# EAGLE design TheSmartTenDollarJobKaufman (EAGLE 6.4)
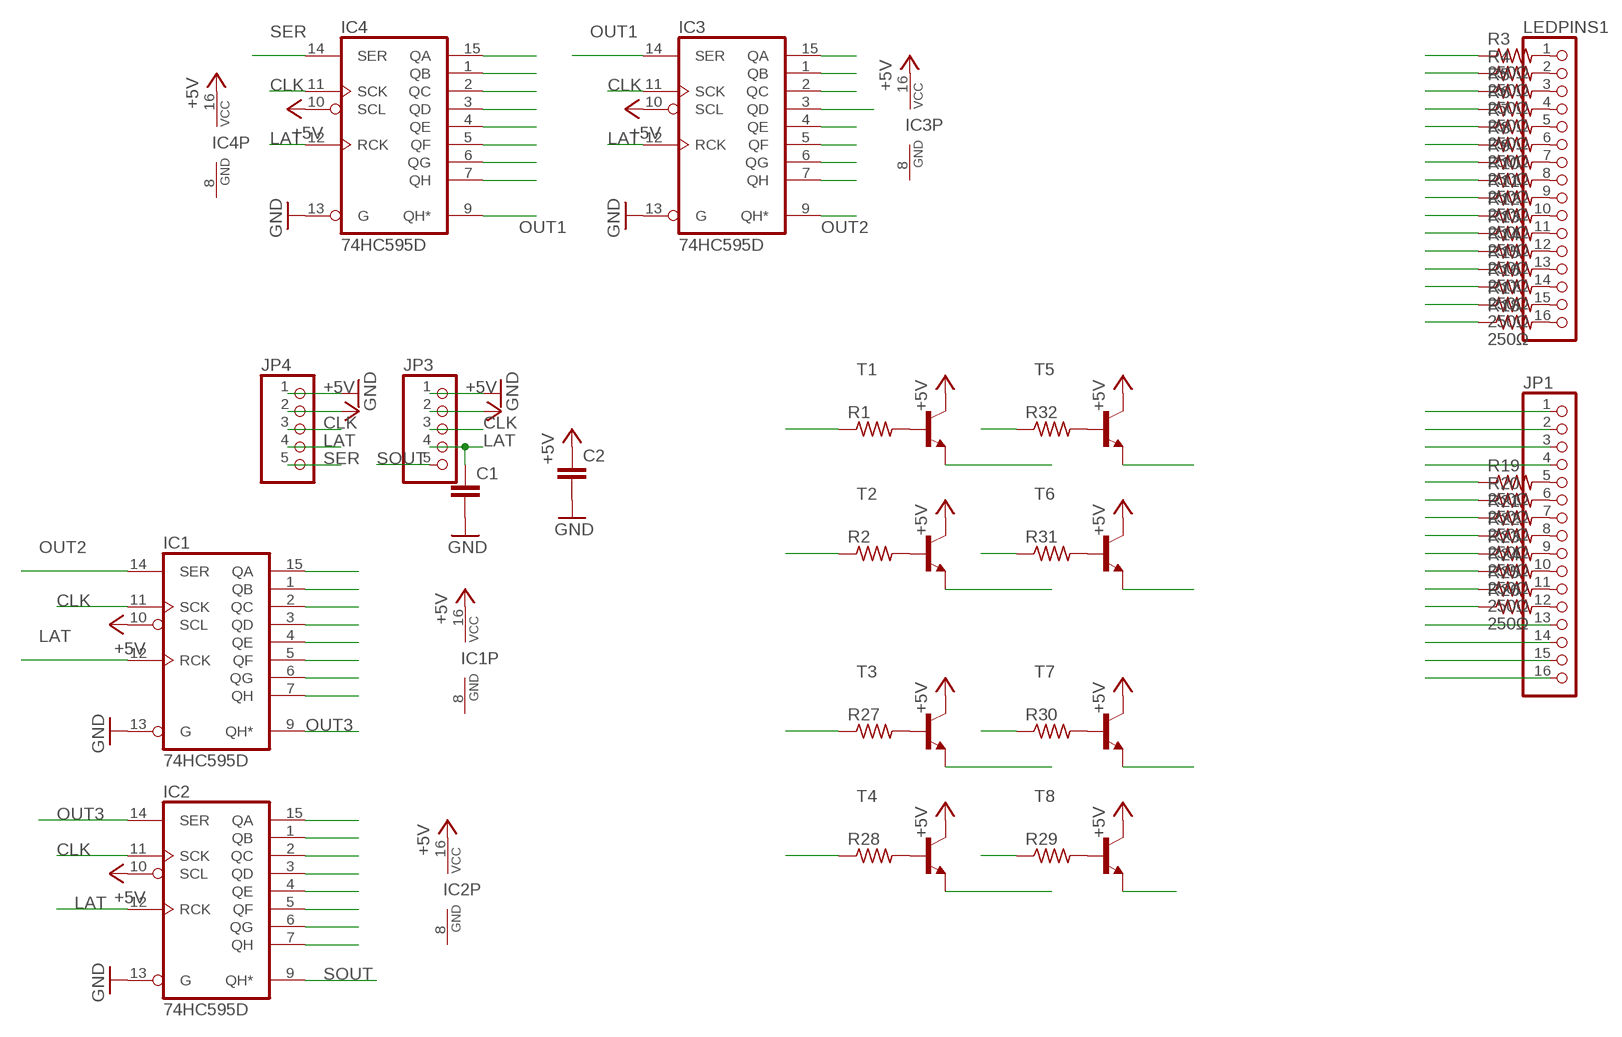
[diagram p0: schematic, sheet 1]

## Parts
C1  C-EUC0603  [C0603]
C2  C-EUC0603  [C0603]
IC1  74HC595D  [SO16]
IC2  74HC595D  [SO16]
IC3  74HC595D  [SO16]
IC4  74HC595D  [SO16]
JP1  PINHD-1X16  [1X16]
JP3  PINHD-1X5  [1X05]
JP4  PINHD-1X5  [1X05]
LEDPINS1  PINHD-1X16  [1X16]
R1  R-US_R0603  [R0603]
R2  R-US_R0603  [R0603]
R3  250Ω  R-US_R0603  [R0603]
R4  250Ω  R-US_R0603  [R0603]
R5  250Ω  R-US_R0603  [R0603]
R6  250Ω  R-US_R0603  [R0603]
R7  250Ω  R-US_R0603  [R0603]
R8  250Ω  R-US_R0603  [R0603]
R9  250Ω  R-US_R0603  [R0603]
R10  250Ω  R-US_R0603  [R0603]
R11  250Ω  R-US_R0603  [R0603]
R12  250Ω  R-US_R0603  [R0603]
R13  250Ω  R-US_R0603  [R0603]
R14  250Ω  R-US_R0603  [R0603]
R15  250Ω  R-US_R0603  [R0603]
R16  250Ω  R-US_R0603  [R0603]
R17  250Ω  R-US_R0603  [R0603]
R18  250Ω  R-US_R0603  [R0603]
R19  250Ω  R-US_R0603  [R0603]
R20  250Ω  R-US_R0603  [R0603]
R21  250Ω  R-US_R0603  [R0603]
R22  250Ω  R-US_R0603  [R0603]
R23  250Ω  R-US_R0603  [R0603]
R24  250Ω  R-US_R0603  [R0603]
R25  250Ω  R-US_R0603  [R0603]
R26  250Ω  R-US_R0603  [R0603]
R27  R-US_R0603  [R0603]
R28  R-US_R0603  [R0603]
R29  R-US_R0603  [R0603]
R30  R-US_R0603  [R0603]
R31  R-US_R0603  [R0603]
R32  R-US_R0603  [R0603]
T1  -NPN-SOT23-CBE  [SOT23-EBC]
T2  -NPN-SOT23-CBE  [SOT23-EBC]
T3  -NPN-SOT23-CBE  [SOT23-EBC]
T4  -NPN-SOT23-CBE  [SOT23-EBC]
T5  -NPN-SOT23-CBE  [SOT23-EBC]
T6  -NPN-SOT23-CBE  [SOT23-EBC]
T7  -NPN-SOT23-CBE  [SOT23-EBC]
T8  -NPN-SOT23-CBE  [SOT23-EBC]

## Nets
+5V: C2.1 IC1.10(SCL) IC1.16(VCC) IC2.10(SCL) IC2.16(VCC) IC3.10(SCL) IC3.16(VCC) IC4.10(SCL) IC4.16(VCC) JP3.2 JP4.2 T1.C T2.C T3.C T4.C T5.C T6.C T7.C T8.C
CLK: IC1.11(SCK) IC2.11(SCK) IC3.11(SCK) IC4.11(SCK) JP3.3 JP4.3
GND: C1.2 C2.2 IC1.13(G) IC2.13(G) IC3.13(G) IC4.13(G) JP3.1 JP4.1
LAT: C1.1 IC1.12(RCK) IC2.12(RCK) IC3.12(RCK) IC4.12(RCK) JP3.4 JP4.4
N$1: IC3.15(QA) R3.1
N$2: IC3.7(QH) R4.1
N$3: IC3.6(QG) R5.1
N$4: IC3.5(QF) R6.1
N$5: IC3.4(QE) R7.1
N$6: IC3.3(QD) R8.1
N$7: IC3.2(QC) R9.1
N$8: IC3.1(QB) R10.1
N$9: IC4.7(QH) R11.1
N$10: IC4.6(QG) R12.1
N$11: IC4.5(QF) R13.1
N$12: IC4.4(QE) R14.1
N$13: IC4.3(QD) R15.1
N$14: IC4.2(QC) R16.1
N$15: IC4.1(QB) R17.1
N$16: IC4.15(QA) R18.1
N$17: JP1.1 T1.B(E)
N$18: JP1.2 T2.B(E)
N$19: JP1.3 T3.B(E)
N$20: JP1.4 T4.B(E)
N$21: IC1.4(QE) R19.1
N$22: IC1.5(QF) R20.1
N$23: IC1.6(QG) R21.1
N$24: IC1.7(QH) R22.1
N$25: IC2.1(QB) R23.1
N$26: IC2.2(QC) R24.1
N$27: IC2.3(QD) R25.1
N$28: IC2.4(QE) R26.1
N$29: JP1.13 T5.B(E)
N$30: JP1.14 T6.B(E)
N$31: JP1.15 T7.B(E)
N$32: JP1.16 T8.B(E)
N$33: LEDPINS1.1 R3.2
N$34: R1.2 T1.E(B)
N$35: LEDPINS1.2 R4.2
N$36: LEDPINS1.3 R5.2
N$37: LEDPINS1.4 R6.2
N$38: LEDPINS1.5 R7.2
N$39: LEDPINS1.6 R8.2
N$40: LEDPINS1.7 R9.2
N$41: LEDPINS1.8 R10.2
N$42: LEDPINS1.9 R11.2
N$43: LEDPINS1.10 R12.2
N$44: LEDPINS1.11 R13.2
N$45: LEDPINS1.12 R14.2
N$46: LEDPINS1.13 R15.2
N$47: LEDPINS1.14 R16.2
N$48: LEDPINS1.15 R17.2
N$49: LEDPINS1.16 R18.2
N$50: JP1.5 R19.2
N$51: JP1.6 R20.2
N$52: JP1.7 R21.2
N$53: JP1.8 R22.2
N$54: JP1.9 R23.2
N$55: JP1.10 R24.2
N$56: JP1.11 R25.2
N$57: JP1.12 R26.2
N$58: R2.2 T2.E(B)
N$59: R27.2 T3.E(B)
N$60: R28.2 T4.E(B)
N$61: R29.2 T8.E(B)
N$62: R30.2 T7.E(B)
N$63: R31.2 T6.E(B)
N$64: R32.2 T5.E(B)
OUT1: IC3.14(SER) IC4.9(QH*)
OUT2: IC1.14(SER) IC3.9(QH*)
OUT3: IC1.9(QH*) IC2.14(SER)
QA: IC1.15(QA) R1.1
QB: IC1.1(QB) R2.1
QC: IC1.2(QC) R27.1
QD: IC1.3(QD) R28.1
QE: IC2.5(QF) R32.1
QF: IC2.6(QG) R31.1
QG: IC2.7(QH) R30.1
QH: IC2.15(QA) R29.1
SER: IC4.14(SER) JP4.5
SOUT: IC2.9(QH*) JP3.5

## Power pins joined to a net without a drawn wire
GND: IC1.8(GND) IC2.8(GND) IC3.8(GND) IC4.8(GND)

## Library data of the parts
C1 C2 = rcl:C-EU: CAPACITOR, European symbol
IC1-IC4 = 74xx-eu:74*595: 8-bit SHIFT REGISTER, output latch
JP1 LEDPINS1 = pinhead:PINHD-1X16: PIN HEADER
JP3 JP4 = pinhead:PINHD-1X5: PIN HEADER
R1 R2 R27-R32 = resistor:R-US_: RESISTOR, American symbol
R3-R26 = rcl:R-US_: RESISTOR, American symbol
T1-T8 = transistor:*-NPN-: NPN Transistror BF959 corrected 2008.03.06

## Board
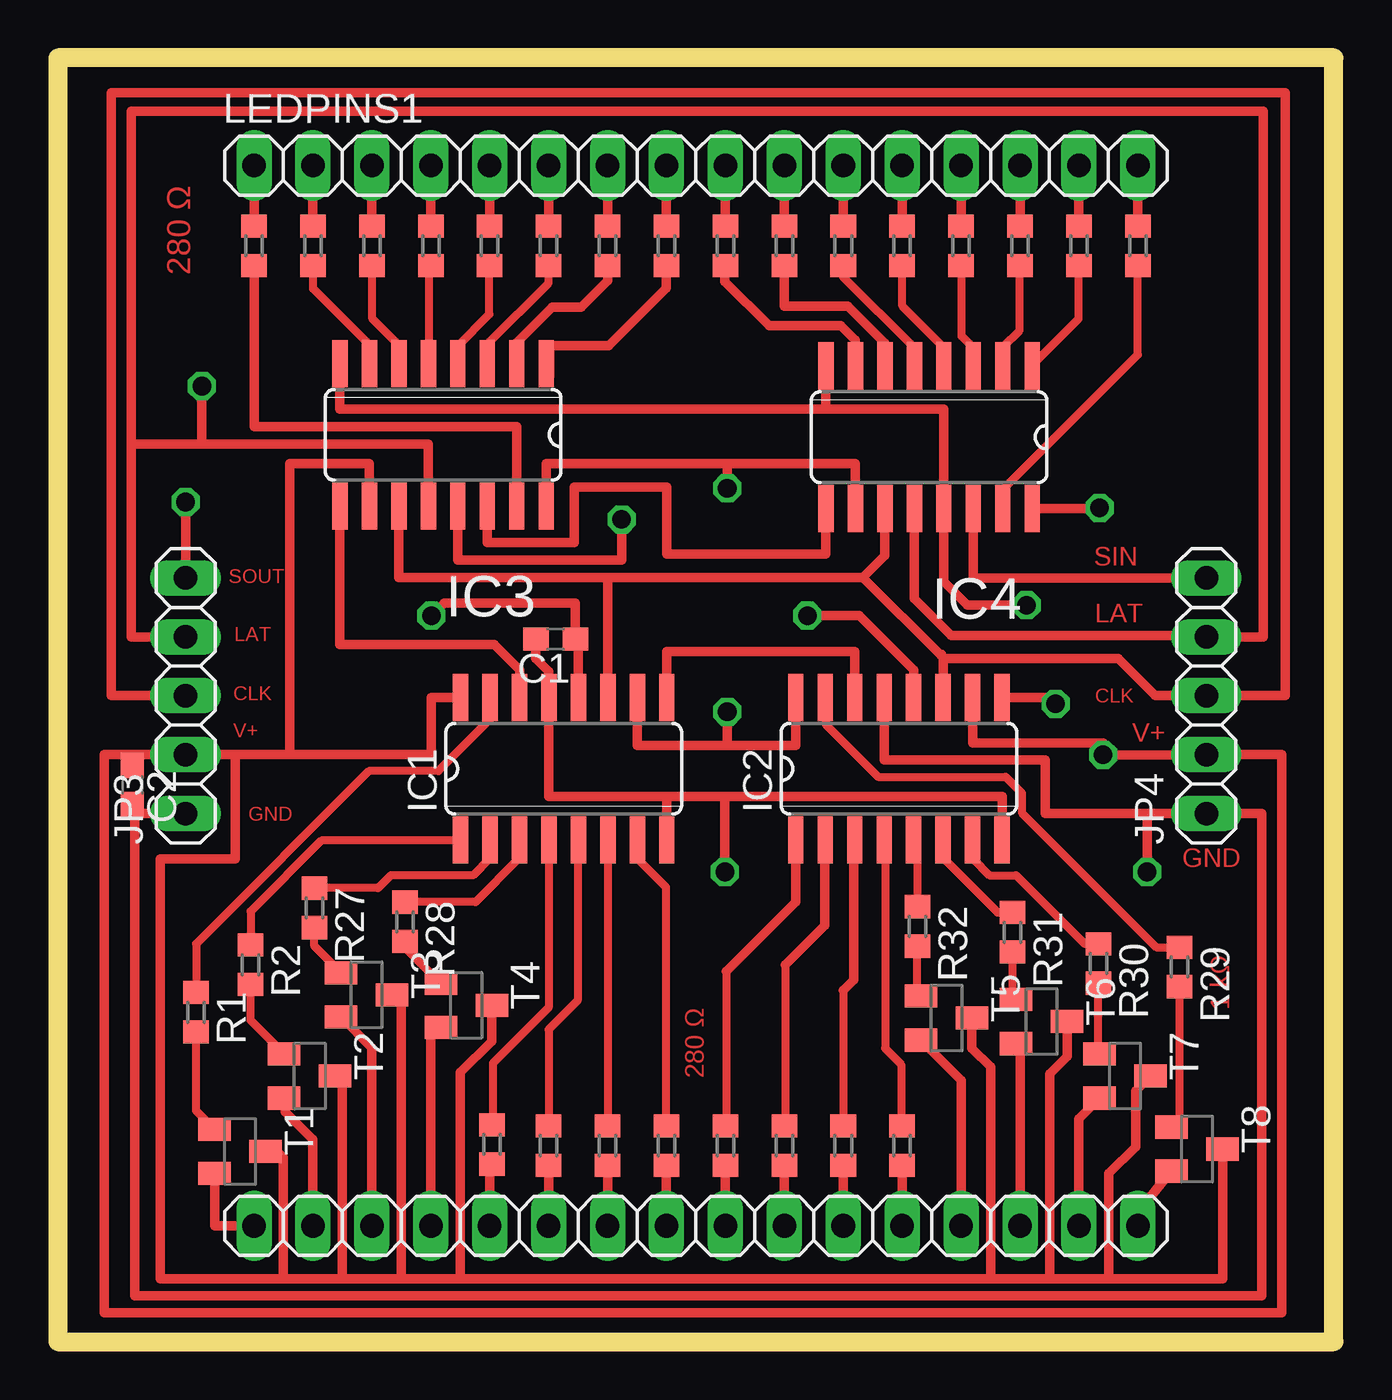
[diagram p1: board, top side]
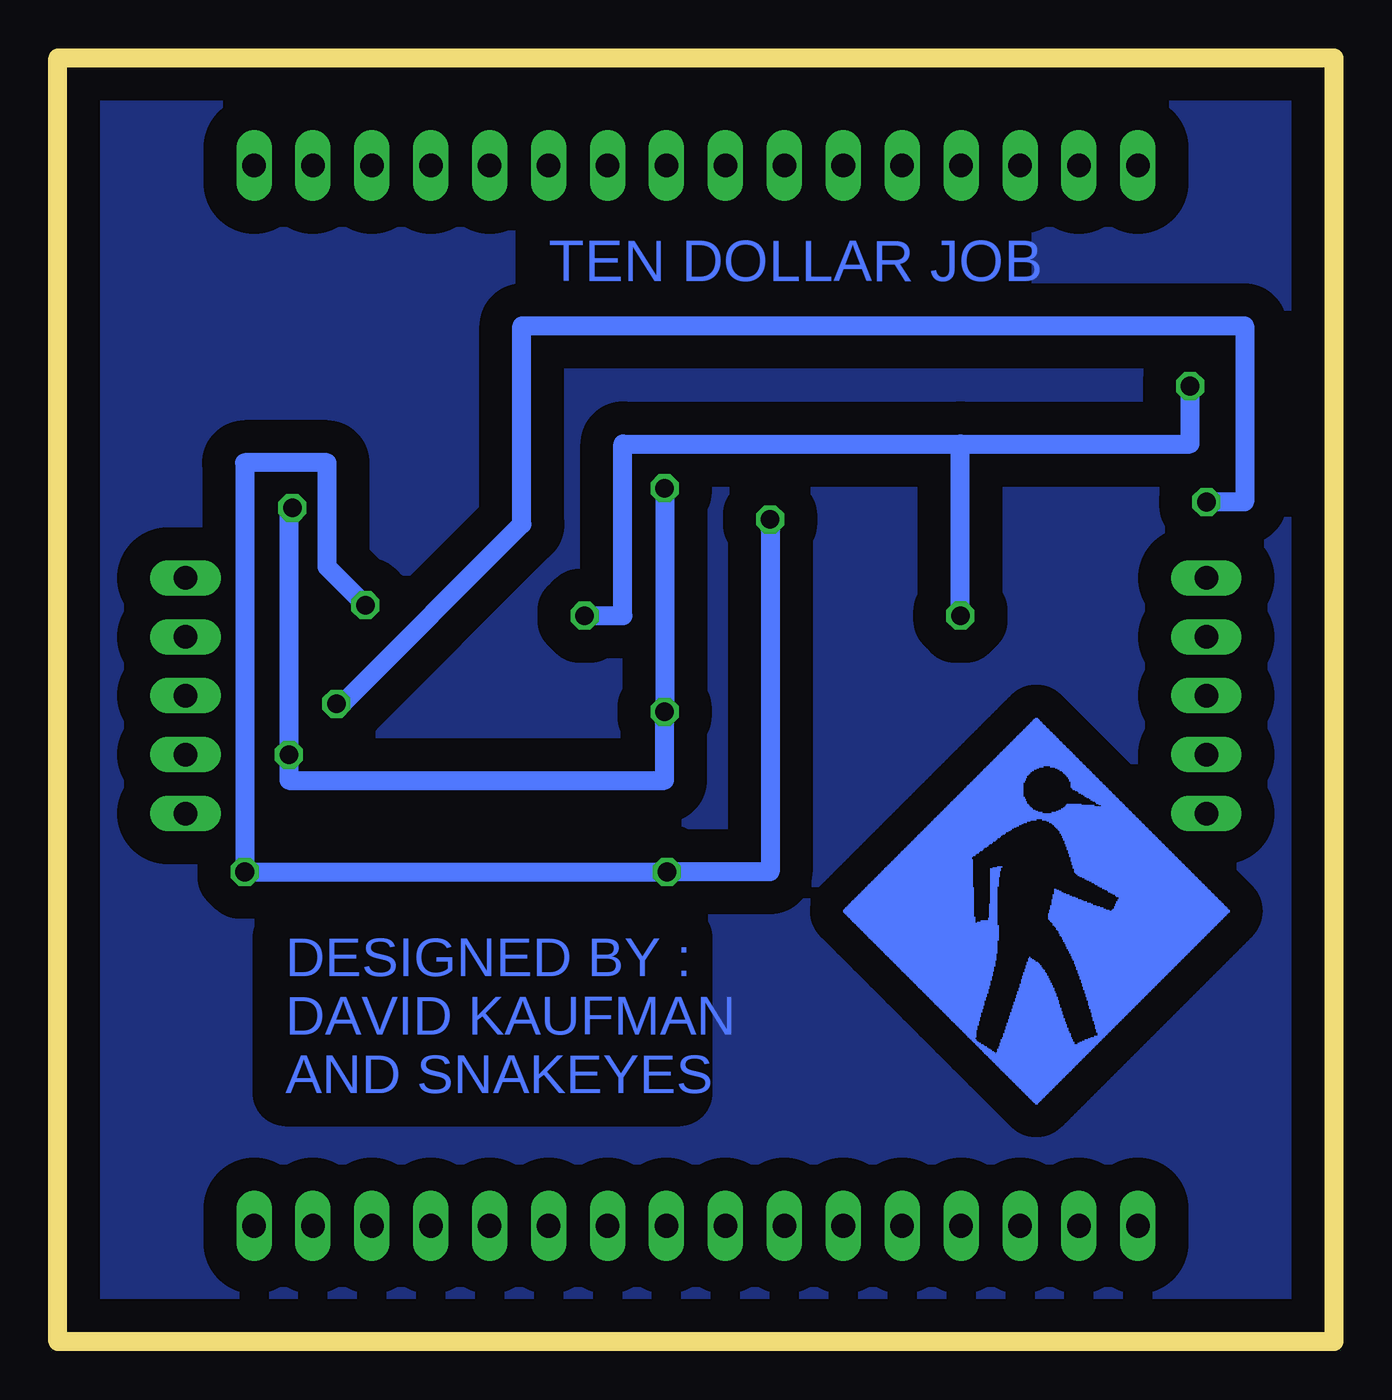
[diagram p2: board, bottom side, seen from below]

Size 55 x 55.35 mm. Coordinates in mm from the lower left corner, seen from the top.
Outline: 0,0 55,0 55,55.35 0,55.35 0,0
Copper layers (1*16): Top 0.035mm / dielectric 1.5mm / Bottom 0.035mm
Design rules "miters": minimum track width 14mil, minimum drill 24mil, track to track 12mil, track to pad 12mil, pad to pad 12mil, via to via 12mil, smd to smd 12mil, copper to edge 40mil, drill to drill 8mil, minimum pad ring 10mil, minimum via ring 8mil, stop-mask expansion 4mil, vias tented up to drill 0mil, thermal gap 10mil

### Footprints (pad centres in the part's own frame; a part is rotated, then mirrored left to right if it is on the bottom)
C0603 = smd 1.1 x 1: 1 -0.85,0; 2 0.85,0
SO16 = smd 0.66 x 2.032: 1 -4.445,-3.073; 2 -3.175,-3.073; 3 -1.905,-3.073; 4 -0.635,-3.073; 5 0.635,-3.073; 6 1.905,-3.073; 7 3.175,-3.073; 8 4.445,-3.073; 9 4.445,3.073; 10 3.175,3.073; 11 1.905,3.073; 12 0.635,3.073; 13 -0.635,3.073; 14 -1.905,3.073; 15 -3.175,3.073; 16 -4.445,3.073
1X16 = drill 1.016 long: 1 -19.05,0; 2 -16.51,0; 3 -13.97,0; 4 -11.43,0; 5 -8.89,0; 6 -6.35,0; 7 -3.81,0; 8 -1.27,0; 9 1.27,0; 10 3.81,0; 11 6.35,0; 12 8.89,0; 13 11.43,0; 14 13.97,0; 15 16.51,0; 16 19.05,0
1X05 = drill 1.016 long: 1 -5.08,0; 2 -2.54,0; 3 0,0; 4 2.54,0; 5 5.08,0
R0603 = smd 1 x 1.1: 1 -0.85,0; 2 0.85,0
SOT23-EBC = smd 1 x 1.4: B 0.95,-1.1; C 0,1.1; E -0.95,-1.1

### Placement (x,y rotation side)
C1  21.45,30.3 180 top
C2  3.2,24 270 top
IC1  21.8,24.7 0 top
IC2  36.25,24.7 0 top
IC3  16.6,39.1 180 top
IC4  37.55,39 180 top
JP1  27.5,4.99 0 top
JP3  5.5,27.85 90 top
JP4  49.5,27.85 90 top
LEDPINS1  27.5,50.71 0 top
R1  5.95,14.2 270 top
R2  8.3,16.25 270 top
R3  8.45,47.25 90 top
R4  10.99,47.25 90 top
R5  13.53,47.25 90 top
R6  16.07,47.25 90 top
R7  18.61,47.25 90 top
R8  21.15,47.25 90 top
R9  23.69,47.25 90 top
R10  26.23,47.25 90 top
R11  28.77,47.25 90 top
R12  31.31,47.25 90 top
R13  33.85,47.25 90 top
R14  36.39,47.25 90 top
R15  38.93,47.25 90 top
R16  41.47,47.25 90 top
R17  44.01,47.25 90 top
R18  46.55,47.25 90 top
R19  18.71,8.5 270 top
R20  21.15,8.45 270 top
R21  23.69,8.45 270 top
R22  26.23,8.45 270 top
R23  28.77,8.45 270 top
R24  31.31,8.45 270 top
R25  33.85,8.45 270 top
R26  36.39,8.45 270 top
R27  11.05,18.7 270 top
R28  14.95,18.1 270 top
R29  48.35,16.15 270 top
R30  44.85,16.3 270 top
R31  41.15,17.65 270 top
R32  37.05,17.9 270 top
T1  7.85,8.2 270 top
T2  10.85,11.45 270 top
T3  13.3,14.95 270 top
T4  17.6,14.5 270 top
T5  38.3,13.95 270 top
T6  42.4,13.8 270 top
T7  46,11.45 270 top
T8  49.1,8.3 270 top

### Tracks (layer width: path | path; a pad name or v marks a point on that pad's centre or on a via)
+5V  (via drill 0.8)
  Top 0.406: 3.65,25.31 2,25.31 2,1.25 52.75,1.25 52.75,25.31 JP4.2 v45.05,25.3 45.05,25.8 39.42,25.8 IC2.10 | 3.65,25.31 JP3.2 | C2.1 3.65,25.31 | JP3.2 7.65,25.31 7.65,20.8 4.4,20.8 4.4,2.7 9.7,2.7 | 9.7,2.7 12.25,2.7 | T1.C 9.45,8.2 9.7,7.95 9.7,2.7 | T2.C 12.25,11.45 12.25,2.7 | T3.C 14.8,14.55 14.8,2.7 | 14.8,2.7 12.25,2.7 | T4.C 18.7,12.95 17.35,11.6 17.35,2.7 | 17.35,2.7 14.8,2.7 | 45.3,2.7 45.3,7.25 46.45,8.4 46.45,10.8 T7.C | 42.75,2.7 42.75,11.55 43.5,12.3 T6.C | 40.2,2.7 40.2,11.85 39.4,12.65 T5.C | 17.35,2.7 40.2,2.7 | 40.2,2.7 42.75,2.7 | 45.3,2.7 42.75,2.7 | 45.3,2.7 50.2,2.7 T8.C | IC1.16 16.1,27.77 16.1,25.31 10,25.31 | 10,25.31 JP3.2 | IC1.10 24.98,25.7 28.85,25.7 | 28.85,25.7 31.8,25.7 IC2.16 | IC4.10 34.38,37.85 28.85,37.85 | 28.85,37.85 21.05,37.85 IC3.16 | IC4.16 44.9,35.93 v44.9,35.95 | v28.85,27.15 28.85,25.7 | v28.85,36.8 28.85,37.85 | IC3.10 13.43,37.85 10,37.85 10,25.31
  Bottom 0.406: v44.9,35.95 45.05,35.95
  Bottom 0.813: 45.05,35.95 v45.05,25.3 45.05,24.2 28.85,24.2 v28.85,27.15 v28.85,36.8
CLK
  Top 0.356: 38.05,29.6 38.1,29.65 38.16,29.45
  Top 0.406: JP3.3 2.3,27.85 2.3,53.85 52.9,53.85 52.9,27.85 JP4.3 47.3,27.85 45.7,29.45 38.16,29.45 IC2.11 | IC3.11 14.7,32.95 23.7,32.95 | 23.7,32.95 IC1.11 | 34.7,32.95 23.7,32.95 | 38.16,29.5 38.05,29.6 34.7,32.95 | 34.7,32.95 35.65,33.9 IC4.11
GND  (via drill 0.8)
  Top 0.406: IC3.8 12.15,40.2 33.1,40.2 | 33.1,40.2 IC4.8 | 33.1,40.2 38.19,40.2 IC4.13 38.19,32.77 39.2,31.75 v41.75,31.75 | JP3.1 3.65,22.77 | 3.65,22.77 3.3,22.77 3.3,1.98 51.9,1.98 51.9,22.77 JP4.1 46.95,22.77 | C2.2 3.65,22.77 | 28.75,23.5 40.7,23.5 IC2.8 | 28.75,23.5 26.25,23.5 | 26.25,23.5 IC1.8 | 26.25,23.5 21.16,23.5 IC1.13 21.16,28.89 20.6,29.45 C1.2 | IC2.13 35.62,25.08 42.55,25.08 42.55,22.77 46.95,22.77 | v46.95,20.25 46.95,22.77 | v28.75,20.25 28.75,23.5 | IC3.13 17.23,33.7 24.3,33.7 v24.3,35.45
  Bottom 0.813: v41.75,31.75 43.4,33.4 43.4,37.9 46.95,37.9 v46.95,20.25 v28.75,20.25 24.3,20.25 v24.3,35.45
LAT  (via drill 0.8)
  Top 0.406: JP3.4 3.15,30.39 3.15,38.7 | 3.15,38.7 3.15,53.05 51.95,53.05 51.95,30.39 JP4.4 49.44,30.45 38.5,30.45 36.91,32.03 IC4.12 | IC3.12 15.96,38.7 6.2,38.7 | 6.2,38.7 3.15,38.7 | IC2.12 36.88,28.96 34.55,31.3 v32.3,31.3 | v6.2,41.2 6.2,38.7 | IC1.12 22.43,30.17 C1.1 22.3,31.85 16.65,31.85 v16.1,31.3
  Bottom 0.813: v32.3,31.3 30.65,31.3 30.65,38.7 16.1,38.7 | v6.2,41.2 6.2,38.7 16.1,38.7 | v16.1,31.3 16.1,38.7
N$1
  Top 0.406: IC3.15 19.77,39.45 8.45,39.45 R3.1
N$2
  Top 0.356: R4.1 11,45.4 13.4,43 13.4,42.2 IC3.7
N$3
  Top 0.356: R5.1 13.55,46.4 13.55,44.1 14.65,43 14.65,42.2 IC3.6
N$4
  Top 0.356: R6.1 16,46.1 16,42.2 IC3.5
  Top 0.406: 15.96,46.3 R6.1
N$5
  Top 0.356: R7.1 18.6,44.3 17.25,42.95 17.25,42.2 IC3.4
N$6
  Top 0.356: R8.1 21.15,45.65 18.55,43.05 18.55,42.2 IC3.3
N$7
  Top 0.406: IC3.2 19.77,43.08 21.3,44.6 22.55,44.6 23.7,45.75 R9.1
N$8
  Top 0.406: R10.1 26.23,45.43 23.75,42.95 21.2,42.95 21.2,41.6 21.1,41.5 21.1,41.4 21.05,41.45 IC3.1
N$9
  Top 0.406: IC4.7 34.38,43.18 33.75,43.8 30.65,43.8 28.75,45.7 28.75,46.38 R11.1
N$10
  Top 0.406: IC4.6 35.65,43.05 34.05,44.65 31.3,44.65 31.31,44.66 R12.1
N$11
  Top 0.356: R13.1 33.85,45.9 36.9,42.85 36.9,42.1 IC4.5
N$12
  Top 0.356: R14.1 36.4,44.65 38.15,42.9 38.15,42.1 IC4.4
N$13
  Top 0.356: R15.1 38.95,46.4 38.95,43.35 39.45,42.85 39.45,42.1 IC4.3
N$14
  Top 0.356: R16.1 41.45,46.4 41.45,43.6 40.75,42.9 40.75,42.1 IC4.2
N$15
  Top 0.356: R17.1 44,44.1 42,42.1 IC4.1
N$16
  Top 0.356: R18.1 46.55,42.55 40.75,36.75 40.75,35.95 IC4.15
N$17
  Top 0.406: T1.B 6.75,4.99 JP1.1
N$18
  Top 0.406: JP1.2 10.99,8.71 9.8,9.9 9.8,10.45 T2.B
N$19
  Top 0.406: T3.B 13.53,12.67 JP1.3
N$20
  Top 0.406: T4.B 16.07,13.12 JP1.4
N$21
  Top 0.356: R19.1 18.75,9.35 18.75,12 21.15,14.4 21.15,21.6 IC1.4
N$22
  Top 0.356: R20.1 21.15,13.45 22.4,14.7 22.4,21.6 IC1.5
N$23
  Top 0.356: R21.1 23.7,21.6 IC1.6
N$24
  Top 0.356: R22.1 26.2,9.3 26.2,19.6 25,20.8 25,21.6 IC1.7
N$25
  Top 0.356: 28.8,15.95 28.8,9.3 R23.1 | 31.8,21.6 IC2.1
  Top 0.406: 31.8,21.6 31.8,18.95 28.8,15.95
N$26
  Top 0.356: 31.35,16.25 31.35,9.3 R24.1 | 33.05,20.8 33.05,21.6 IC2.2
  Top 0.406: 33.05,20.8 33.05,17.95 31.35,16.25
N$27
  Top 0.356: 33.85,15.15 R25.1 | 34.3,20.8 34.3,21.6 IC2.3
  Top 0.406: 34.3,20.8 34.3,15.6 33.85,15.15
N$28
  Top 0.356: R26.1 36.35,9.3 36.35,11.95 35.65,12.65 35.65,21.6 IC2.4
N$29
  Top 0.406: T5.B 38.93,11.27 JP1.13
N$30
  Top 0.406: T6.B 41.47,12.68 JP1.14
N$31
  Top 0.406: JP1.15 44,9.6 T7.B
N$32
  Top 0.406: T8.B 46.55,5.55 JP1.16
N$33
  Top 0.406: R3.2 LEDPINS1.1
N$34
  Top 0.356: R1.2 5.95,9.95 T1.E
N$35
  Top 0.406: LEDPINS1.2 R4.2
N$36
  Top 0.406: R5.2 LEDPINS1.3
N$37
  Top 0.406: LEDPINS1.4 R6.2
N$38
  Top 0.406: R7.2 LEDPINS1.5
N$39
  Top 0.406: LEDPINS1.6 R8.2
N$40
  Top 0.406: R9.2 LEDPINS1.7
N$41
  Top 0.406: LEDPINS1.8 R10.2
N$42
  Top 0.406: R11.2 LEDPINS1.9
N$43
  Top 0.406: LEDPINS1.10 R12.2
N$44
  Top 0.406: R13.2 LEDPINS1.11
N$45
  Top 0.406: LEDPINS1.12 R14.2
N$46
  Top 0.406: R15.2 LEDPINS1.13
N$47
  Top 0.406: LEDPINS1.14 R16.2
N$48
  Top 0.406: R17.2 LEDPINS1.15
N$49
  Top 0.406: LEDPINS1.16 R18.2
N$50
  Top 0.406: JP1.5 18.61,7.55 R19.2
N$51
  Top 0.406: R20.2 JP1.6
N$52
  Top 0.406: R21.2 JP1.7
N$53
  Top 0.406: R22.2 JP1.8
N$54
  Top 0.406: R23.2 JP1.9
N$55
  Top 0.406: R24.2 JP1.10
N$56
  Top 0.406: R25.2 JP1.11
N$57
  Top 0.406: R26.2 JP1.12
N$58
  Top 0.356: R2.2 8.3,13.85 T2.E
N$59
  Top 0.356: R27.2 11.05,17.05 T3.E
N$60
  Top 0.356: R28.2 14.95,17 T4.E
N$61
  Top 0.356: R29.2 48.35,9.6 T8.E
N$62
  Top 0.356: R30.2 44.85,12.45 T7.E
N$63
  Top 0.356: R31.2 41.15,14.9 T6.E
N$64
  Top 0.356: R32.2 37.05,15.05 T5.E
N$66
  pour Bottom (isolate 1.422): 0,55.3 54.95,55.3 54.95,0 0,0
OUT1
  Top 0.406: IC4.9 33.1,33.95 26.25,33.95 26.25,36.85 22.25,36.85 22.25,34.45 18.5,34.45 IC3.14
OUT2
  Top 0.406: IC3.9 12.15,30.05 18.8,30.05 19.89,28.96 IC1.14
OUT3
  Top 0.406: IC1.9 26.25,29.75 34.34,29.75 IC2.14
QA
  Top 0.356: R1.1 5.95,17.15 13.4,24.6 16.4,24.6 18.6,26.8 18.6,27.75 IC1.15
QB
  Top 0.356: R2.1 8.3,18.55 11.35,21.6 17.35,21.6 IC1.1
QC
  Top 0.356: R27.1 13.8,19.55 14.35,20.1 17.9,20.1 18.6,20.8 18.6,21.6 IC1.2
QD
  Top 0.356: R28.1 18,18.95 19.85,20.8 19.85,21.6 IC1.3
QE
  Top 0.356: R32.1 37.05,21.45 36.9,21.6 IC2.5
QF
  Top 0.356: R31.1 40.5,18.5 38.2,20.8 38.2,21.6 IC2.6
QG
  Top 0.356: R30.1 44.25,17.15 41.3,20.1 40.15,20.1 39.45,20.8 39.45,21.6 IC2.7
QH
  Top 0.356: R29.1 47.35,17 41.55,22.8 41.55,23.65 40.85,24.35 35.35,24.35 33.1,26.6 33.1,27.75 IC2.15
SER
  Top 0.406: JP4.5 39.45,32.93 IC4.14
SOUT  (via drill 0.8)
  Top 0.406: IC2.9 42.73,27.77 v43,27.5 | v5.5,36.2 JP3.5
  Bottom 0.406: v43,27.5 42.75,27.5
  Bottom 0.813: 42.75,27.5 35,35.25 35,43.8 3.85,43.8 3.85,36.2 v5.5,36.2
(copper drawn outside any net)
  shapes: Bottom area x710

### Text on the board
Top: 280 Ω | SIN | SOUT | LAT | LAT | CLK | CLK | V+ | V+ | GND | GND | 1 kΩ | 280 Ω
Bottom: TEN DOLLAR JOB | DESIGNED BY : / DAVID KAUFMAN / AND SNAKEYES